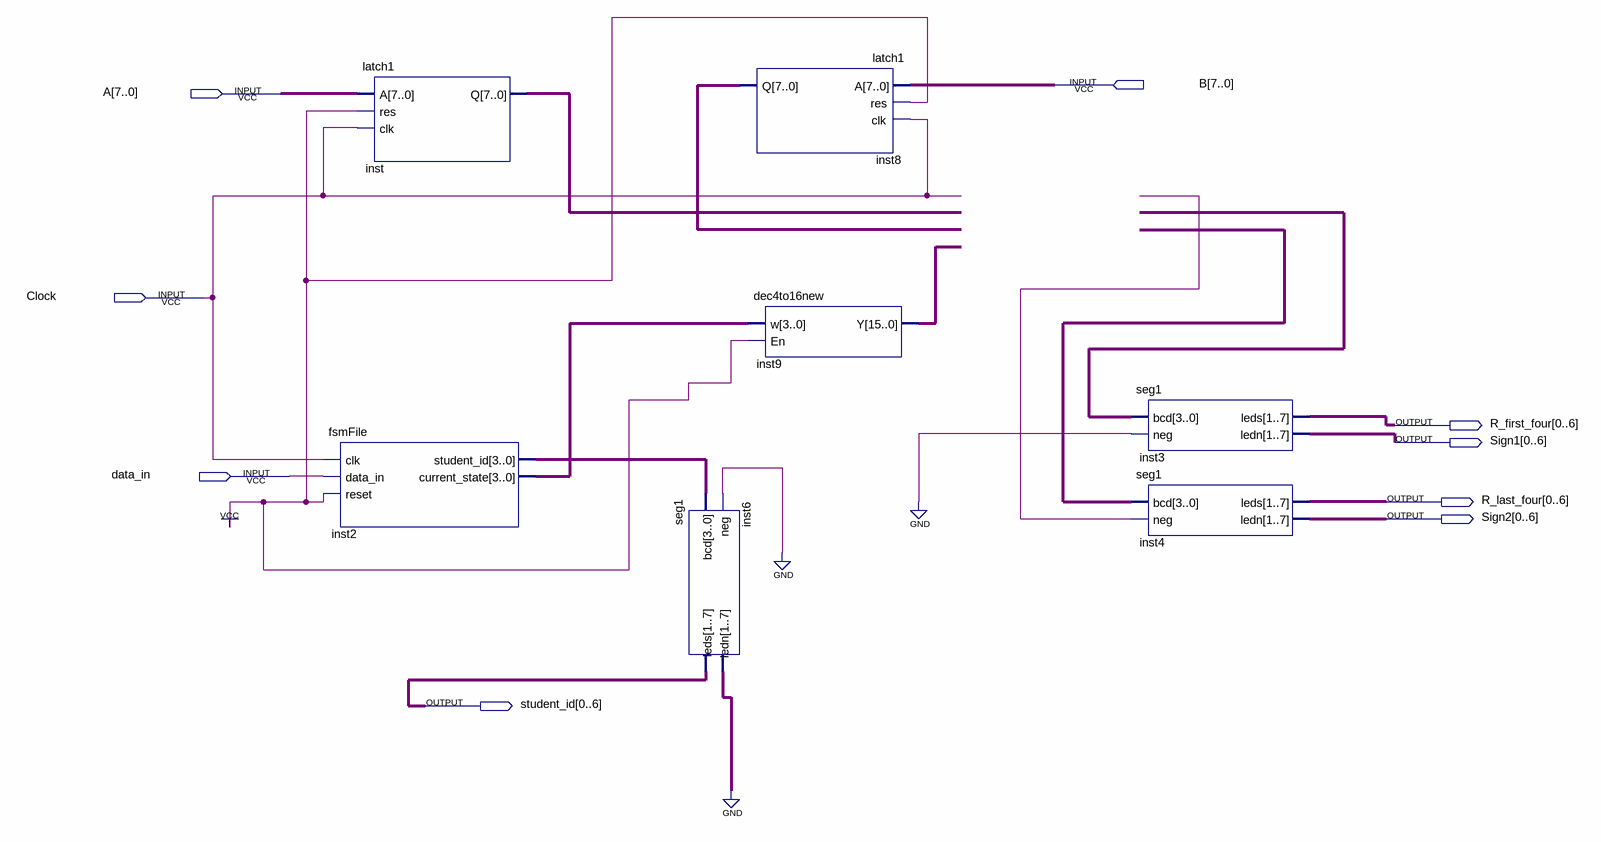
[diagram p0: schematic sheet]
// Quartus schematic Block2Test.bdf as structural Verilog: 7 symbols, 9 pins
module Block2Test (
  input  [7:0] B,
  input  [7:0] A,
  input  Clock,
  input  data_in,
  output [0:6] R_first_four,
  output [0:6] Sign1,
  output [0:6] R_last_four,
  output [0:6] Sign2,
  output [0:6] student_id
);

  wire undriven_3;
  wire [3:0] inst2_current_state, inst2_student_id, undriven, undriven_2;
  wire [6:0] inst6_ledn;
  wire [7:0] inst8_q, inst_q;
  wire [15:0] inst9_y;

  fsmFile inst2 (
    .clk(Clock), .data_in(data_in), .reset(1'b1), .student_id(inst2_student_id),
    .current_state(inst2_current_state));
  latch1 inst (.A(A), .res(1'b1), .clk(Clock), .Q(inst_q));
  seg1 inst6 (.bcd(inst2_student_id), .neg(1'b0), .leds(student_id), .ledn(inst6_ledn));
  latch1 inst8 (.A(B), .res(1'b1), .clk(Clock), .Q(inst8_q));
  dec4to16new inst9 (.w(inst2_current_state), .En(1'b1), .Y(inst9_y));
  seg1 inst3 (.bcd(undriven_2), .neg(1'b0), .leds(R_first_four), .ledn(Sign1));
  seg1 inst4 (.bcd(undriven), .neg(undriven_3), .leds(R_last_four), .ledn(Sign2));
  // also tied to GND on the sheet: {inst6_ledn[0], inst6_ledn[1], inst6_ledn[2], inst6_ledn[3], inst6_ledn[4], inst6_ledn[5], inst6_ledn[6]}
endmodule
